# Altium schematic sheet merci_main.SchDoc
size A4; SheetNumber: 1; SheetTotal: 1
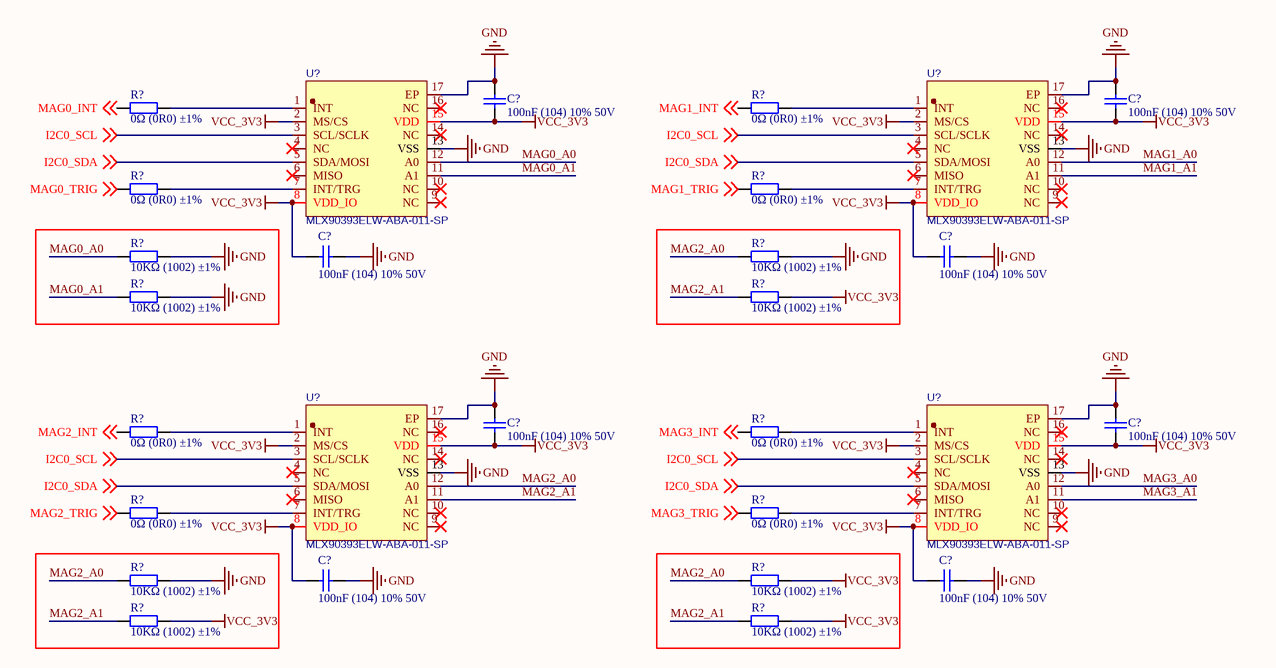
[diagram p0: merci_main.SchDoc]

## Parts
(Parts that share a designator on the sheet are numbered #1, #2 ... from top to bottom, then left to right.)
C?#1  100nF (104) 10% 50V  [LC-0603_C]
C?#2  100nF (104) 10% 50V  [LC-0603_C]
C?#3  100nF (104) 10% 50V  [LC-0603_C]
C?#4  100nF (104) 10% 50V  [LC-0603_C]
C?#5  100nF (104) 10% 50V  [LC-0603_C]
C?#6  100nF (104) 10% 50V  [LC-0603_C]
C?#7  100nF (104) 10% 50V  [LC-0603_C]
C?#8  100nF (104) 10% 50V  [LC-0603_C]
R?#1  0Ω (0R0) ±1%  [LC-0603_R]
R?#2  0Ω (0R0) ±1%  [LC-0603_R]
R?#3  0Ω (0R0) ±1%  [LC-0603_R]
R?#4  0Ω (0R0) ±1%  [LC-0603_R]
R?#5  10KΩ (1002) ±1%  [LC-0603_R]
R?#6  10KΩ (1002) ±1%  [LC-0603_R]
R?#7  10KΩ (1002) ±1%  [LC-0603_R]
R?#8  10KΩ (1002) ±1%  [LC-0603_R]
R?#9  0Ω (0R0) ±1%  [LC-0603_R]
R?#10  0Ω (0R0) ±1%  [LC-0603_R]
R?#11  0Ω (0R0) ±1%  [LC-0603_R]
R?#12  0Ω (0R0) ±1%  [LC-0603_R]
R?#13  10KΩ (1002) ±1%  [LC-0603_R]
R?#14  10KΩ (1002) ±1%  [LC-0603_R]
R?#15  10KΩ (1002) ±1%  [LC-0603_R]
R?#16  10KΩ (1002) ±1%  [LC-0603_R]
U?#1  MLX90393ELW-ABA-011-SP  [QFN-16_L3.0-W3.0-P0.50-TR-EP1.7]
U?#2  MLX90393ELW-ABA-011-SP  [QFN-16_L3.0-W3.0-P0.50-TR-EP1.7]
U?#3  MLX90393ELW-ABA-011-SP  [QFN-16_L3.0-W3.0-P0.50-TR-EP1.7]
U?#4  MLX90393ELW-ABA-011-SP  [QFN-16_L3.0-W3.0-P0.50-TR-EP1.7]

## Nets
GND: C?#1.2 C?#2.2 C?#3.1 C?#4.1 C?#5.2 C?#6.2 C?#7.1 C?#8.1 R?#5.1 R?#6.1 R?#7.1 R?#13.1 U?#1.13(VSS) U?#1.17(EP) U?#2.13(VSS) U?#2.17(EP) U?#3.13(VSS) U?#3.17(EP) U?#4.13(VSS) U?#4.17(EP)
VCC_3V3: C?#1.1 C?#2.1 C?#3.2 C?#4.2 C?#5.1 C?#6.1 C?#7.2 C?#8.2 R?#8.1 R?#14.1 R?#15.1 R?#16.1 U?#1.2(MS/CS) U?#1.8(VDD_IO) U?#1.15(VDD) U?#2.2(MS/CS) U?#2.8(VDD_IO) U?#2.15(VDD) U?#3.2(MS/CS) U?#3.8(VDD_IO) U?#3.15(VDD) U?#4.2(MS/CS) U?#4.8(VDD_IO) U?#4.15(VDD)
I2C0_SCL: U?#1.3(SCL/SCLK) U?#2.3(SCL/SCLK) U?#3.3(SCL/SCLK) U?#4.3(SCL/SCLK) ; off-sheet I2C0_SCL
I2C0_SDA: U?#1.5(SDA/MOSI) U?#2.5(SDA/MOSI) U?#3.5(SDA/MOSI) U?#4.5(SDA/MOSI) ; off-sheet I2C0_SDA
MAG0_A0: R?#5.2 U?#1.12(A0)
MAG0_A1: R?#7.2 U?#1.11(A1)
MAG0_INT: R?#1.1 ; off-sheet MAG0_INT
MAG0_TRIG: R?#3.1 ; off-sheet MAG0_TRIG
MAG1_A0: U?#2.12(A0)
MAG1_A1: U?#2.11(A1)
MAG1_INT: R?#2.1 ; off-sheet MAG1_INT
MAG1_TRIG: R?#4.1 ; off-sheet MAG1_TRIG
MAG2_A0: R?#6.2 R?#13.2 R?#14.2 U?#3.12(A0)
MAG2_A1: R?#8.2 R?#15.2 R?#16.2 U?#3.11(A1)
MAG2_INT: R?#9.1 ; off-sheet MAG2_INT
MAG2_TRIG: R?#11.1 ; off-sheet MAG2_TRIG
MAG3_A0: U?#4.12(A0)
MAG3_A1: U?#4.11(A1)
MAG3_INT: R?#10.1 ; off-sheet MAG3_INT
MAG3_TRIG: R?#12.1 ; off-sheet MAG3_TRIG
NetR?#1_2: R?#1.2 U?#1.1(INT)
NetR?#2_2: R?#2.2 U?#2.1(INT)
NetR?#3_2: R?#3.2 U?#1.7(INT/TRG)
NetR?#4_2: R?#4.2 U?#2.7(INT/TRG)
NetR?#9_2: R?#9.2 U?#3.1(INT)
NetR?#10_2: R?#10.2 U?#4.1(INT)
NetR?#11_2: R?#11.2 U?#3.7(INT/TRG)
NetR?#12_2: R?#12.2 U?#4.7(INT/TRG)

Not connected (* = marked no-connect by the designer): U?#1 4(NC)* 6(MISO)* 9(NC)* 10(NC)* 14(NC)* 16(NC)*; U?#2 4(NC)* 6(MISO)* 9(NC)* 10(NC)* 14(NC)* 16(NC)*; U?#3 4(NC)* 6(MISO)* 9(NC)* 10(NC)* 14(NC)* 16(NC)*; U?#4 4(NC)* 6(MISO)* 9(NC)* 10(NC)* 14(NC)* 16(NC)*

## Library data of the parts
C?#1-C?#8 = 0603 100nF (104) 10% 50V: 贴片电容; ComponentLink1Description: 供应商链接; ComponentLink1URL: http://www.szlcsc.com/product/details_15331.html; Package: 0603; Supplier: LC; SuppliersPartNumber: C14663
R?#1-R?#4 R?#9-R?#12 = 0603 0Ω (0R0) 1%: 贴片电阻; ComponentLink1Description: 供应商链接; ComponentLink1URL: http://www.szlcsc.com/product/details_21903.html; Package: 0603; Supplier: LC; SuppliersPartNumber: C21189
R?#5-R?#8 R?#13-R?#16 = 0603 10KΩ (1002) 1%: 贴片电阻; ComponentLink1Description: 供应商链接; ComponentLink1URL: http://www.szlcsc.com/product/details_26547.html; Package: 0603; Supplier: LC; SuppliersPartNumber: C25804
U?#1-U?#4 = MLX90393ELW-ABA-011-SP: BOM_Manufacturer: Melexis(比利时迈来芯); Contributor: LCSC; BOM_Supplier: LCSC; BOM_Supplier Part: C1526586; BOM_Manufacturer Part: MLX90393ELW-ABA-011-SP; BOM_JLCPCB Part Class: Extended Part; spicePre: U; spiceSymbolName: MLX90393ELW-ABA-011-SP